# EAGLE schematic Robot Car (EAGLE 9.0.1)
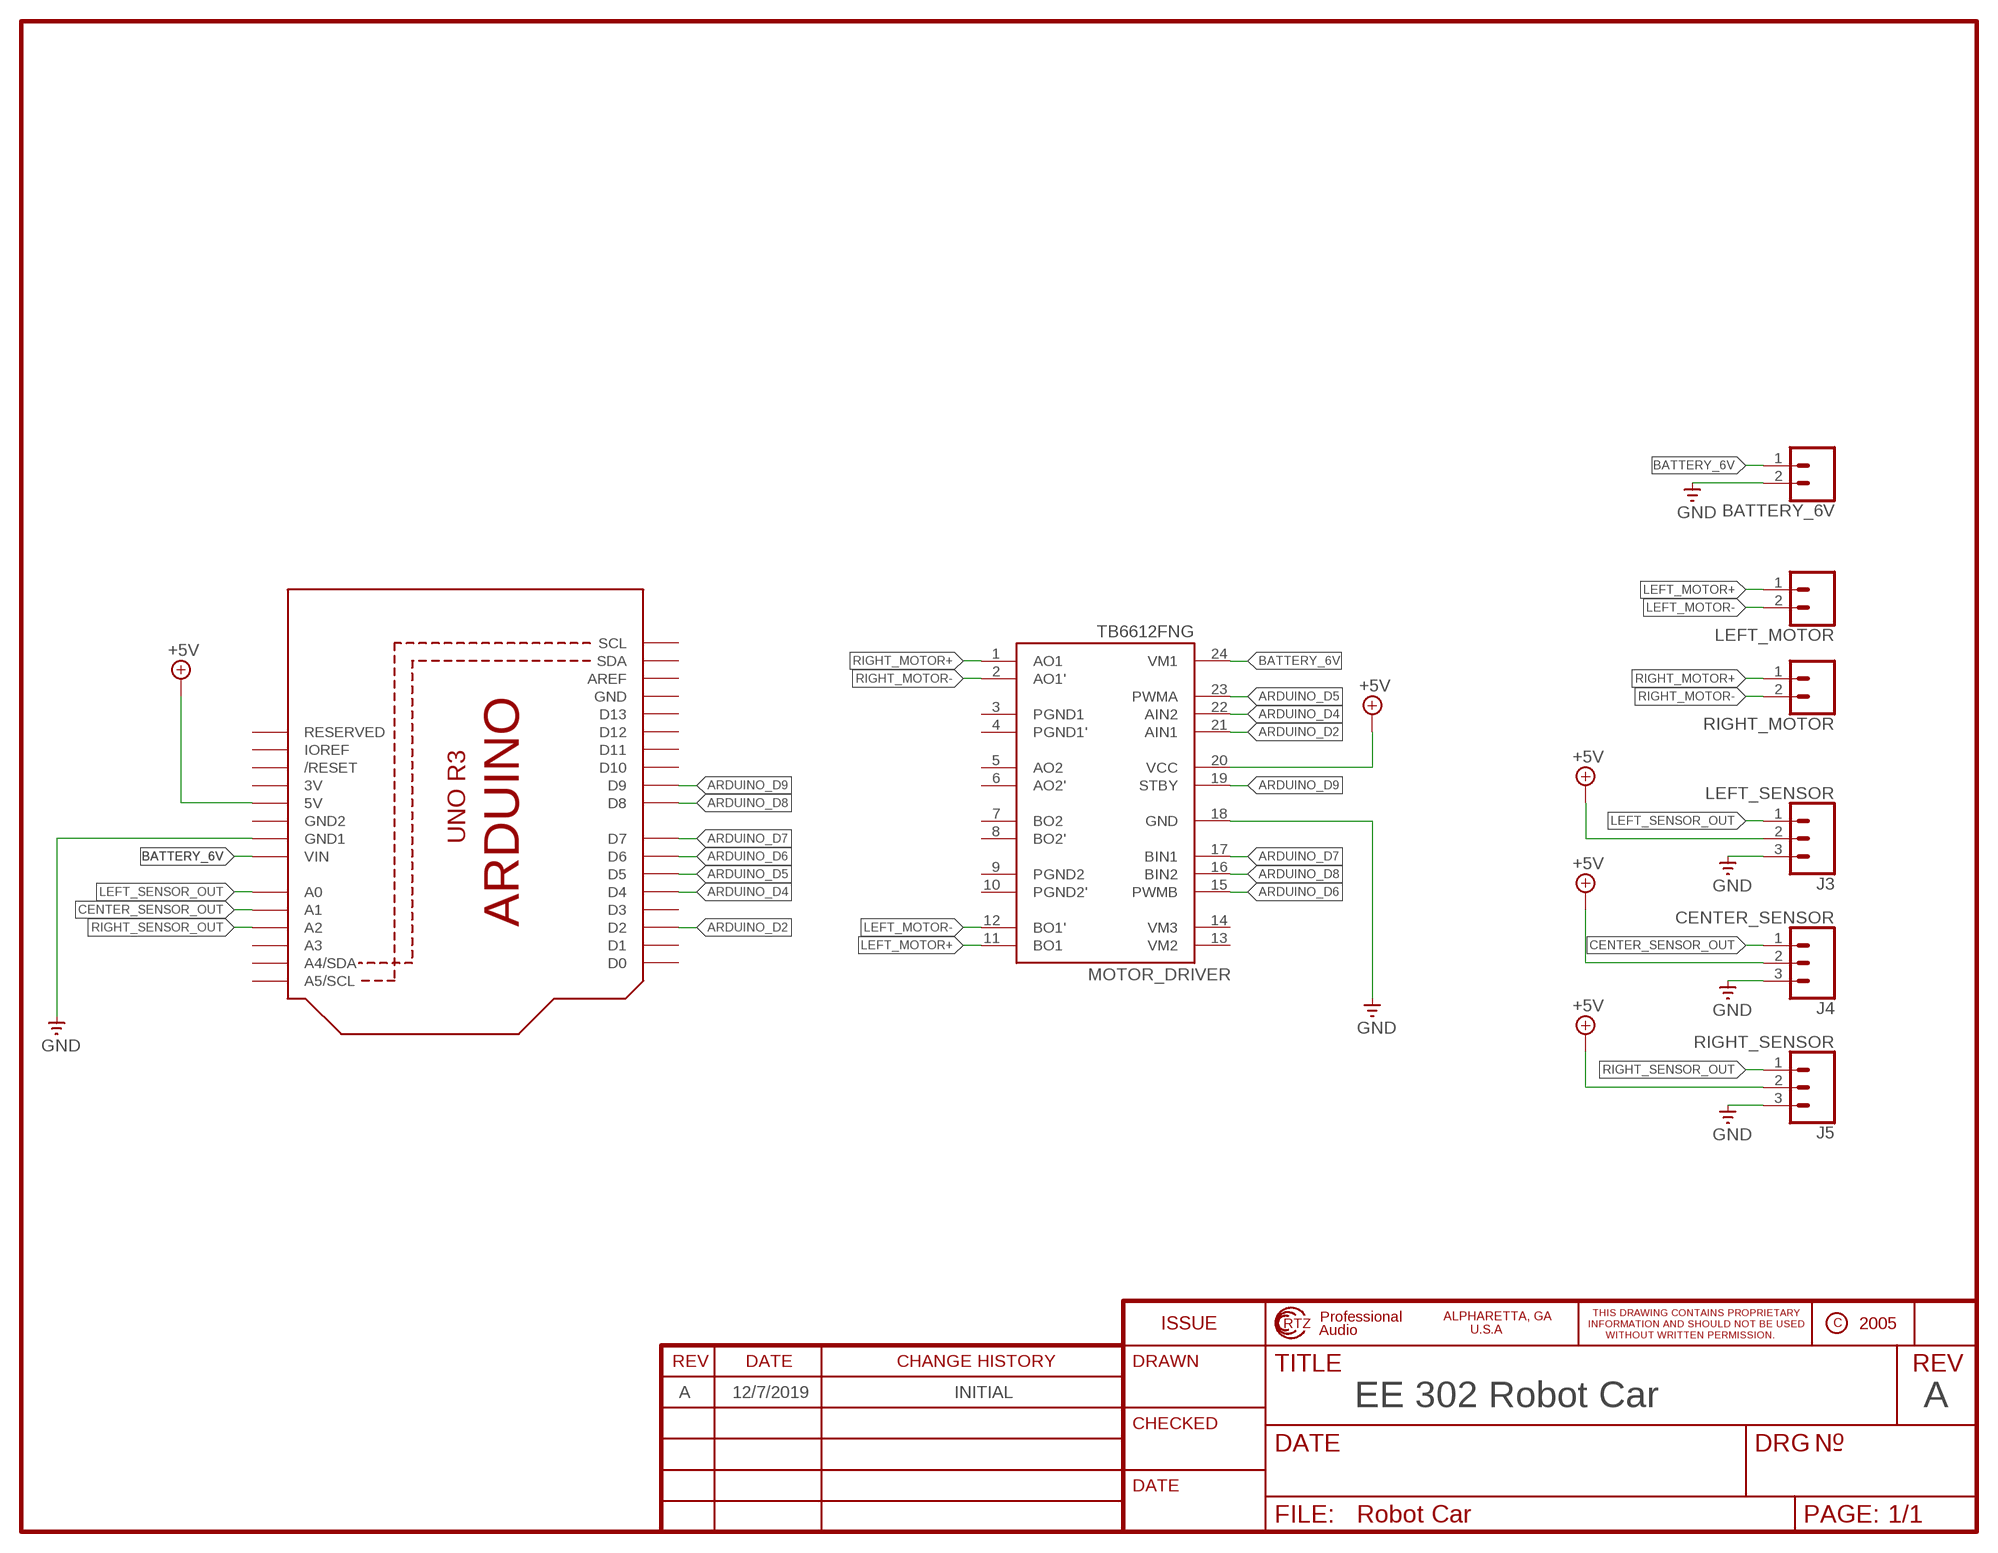
[diagram p0: schematic, sheet 1]

## Parts
BATTERY_6V  CONN_02  [1X02]
J3  LEFT_SENSOR  CONN_03  [1X03]
J4  CENTER_SENSOR  CONN_03  [1X03]
J5  RIGHT_SENSOR  CONN_03  [1X03]
LEFT_MOTOR  CONN_02  [1X02]
MOTOR_DRIVER  TB6612FNG  [SSOP24]
RIGHT_MOTOR  CONN_02  [1X02]
U1  ARDUINOR3-DIMENSION  [ARDUINOR3]

## Nets
+5V: J3.2 J4.2 J5.2 MOTOR_DRIVER.20(VCC) U1.5V
ARDUINO_D2: MOTOR_DRIVER.21(AIN1) U1.D2
ARDUINO_D4: MOTOR_DRIVER.22(AIN2) U1.D4
ARDUINO_D5: MOTOR_DRIVER.23(PWMA) U1.D5
ARDUINO_D6: MOTOR_DRIVER.15(PWMB) U1.D6
ARDUINO_D7: MOTOR_DRIVER.17(BIN1) U1.D7
ARDUINO_D8: MOTOR_DRIVER.16(BIN2) U1.D8
ARDUINO_D9: MOTOR_DRIVER.19(STBY) U1.D9
BATTERY_6V: BATTERY_6V.1 MOTOR_DRIVER.24(VM1) U1.VIN
CENTER_SENSOR_OUT: J4.1 U1.A1
GND: BATTERY_6V.2 J3.3 J4.3 J5.3 MOTOR_DRIVER.18(GND) U1.GND1
LEFT_MOTOR+: LEFT_MOTOR.1 MOTOR_DRIVER.11(BO1)
LEFT_MOTOR-: LEFT_MOTOR.2 MOTOR_DRIVER.12(BO1')
LEFT_SENSOR_OUT: J3.1 U1.A0
RIGHT_MOTOR+: MOTOR_DRIVER.1(AO1) RIGHT_MOTOR.1
RIGHT_MOTOR-: MOTOR_DRIVER.2(AO1') RIGHT_MOTOR.2
RIGHT_SENSOR_OUT: J5.1 U1.A2
Unconnected: MOTOR_DRIVER.5(AO2) MOTOR_DRIVER.6(AO2') MOTOR_DRIVER.7(BO2) MOTOR_DRIVER.8(BO2') U1.A3 U1.A4(A4/SDA) U1.A5(A5/SCL) U1.AREF U1.D0 U1.D1 U1.D3 U1.D10 U1.D11 U1.D12 U1.D13 U1.IOREF U1.RESERVED U1.RESET(/RESET) U1.SCL U1.SDA

## Notes on the sheet
- A | 12/7/2019 | INITIAL
- EE 302 Robot Car | A

## Power pins joined to a net without a drawn wire
3V: U1.3V
GND: U1.GND
GND2: U1.GND2
PGND1: MOTOR_DRIVER.3(PGND1)
PGND1': MOTOR_DRIVER.4(PGND1')
PGND2: MOTOR_DRIVER.9(PGND2)
PGND2': MOTOR_DRIVER.10(PGND2')
VM2: MOTOR_DRIVER.13(VM2)
VM3: MOTOR_DRIVER.14(VM3)

## Library data of the parts
BATTERY_6V LEFT_MOTOR RIGHT_MOTOR = SparkFun-Connectors:CONN_02: Multi connection point. Often used as Generic Header-pin footprint for 0.1 inch spaced/style header connections On any of the 0.1 inch spaced packages, you can populate with these: Break Away Headers - Straight <https://www.sparkfun.com/products/116> (PRT-00116) Break Away Male Headers - Right Angle <https://www.sparkfun.com/products/553> (PRT-00553) Female Headers <https://www.sparkfun.com/products/115> (PRT-00115) Break Away Headers - Machine Pin <https://www.sparkfun.com/products/117> (PRT-00117) Break Away Female Headers - Swiss Machine Pin <https://www.sparkfun.com/products/743> (PRT-00743) For SCREWTERMINALS and SPRING TERMINALS visit here: Screw Terimnals on SparkFun.com <https://www.sparkfun.com/search/results?term=Screw+Terminals> (5mm/3.5mm/2.54mm spacing) This device is also useful as a general connection point to wire up your design to another part of your project. Our various solder wires solder well into these plated through hole pads. Hook-Up Wire - Assortment (Stranded, 22 AWG) <https://www.sparkfun.com/products/11375> (PRT-11375) Hook-Up Wire - Assortment (Solid Core, 22 AWG) <https://www.sparkfun.com/products/11367> (PRT-11367) View the entire wire category on our website here <https://www.sparkfun.com/categories/141> Special notes: Molex polarized connector foot print use with: PRT-08233 with associated crimp pins and housings. 2.54_SCREWTERM for use with PRT-10571. 3.5mm Screw Terminal footprints for PRT-08084 5mm Screw Terminal footprints for use with PRT-08432
J3-J5 = SparkFun-Connectors:CONN_03: Multi connection point. Often used as Generic Header-pin footprint for 0.1 inch spaced/style header connections On any of the 0.1 inch spaced packages, you can populate with these: Break Away Headers - Straight <https://www.sparkfun.com/products/116> (PRT-00116) Break Away Male Headers - Right Angle <https://www.sparkfun.com/products/553> (PRT-00553) Female Headers <https://www.sparkfun.com/products/115> (PRT-00115) Break Away Headers - Machine Pin <https://www.sparkfun.com/products/117> (PRT-00117) Break Away Female Headers - Swiss Machine Pin <https://www.sparkfun.com/products/743> (PRT-00743) Stackable Header - 3 Pin (Female, 0.1") <https://www.sparkfun.com/products/13875> (PRT-13875) For SCREWTERMINALS and SPRING TERMINALS visit here: Screw Terimnals on SparkFun.com <https://www.sparkfun.com/search/results?term=Screw+Terminals> (5mm/3.5mm/2.54mm spacing) This device is also useful as a general connection point to wire up your design to another part of your project. Our various solder wires solder well into these plated through hole pads. Hook-Up Wire - Assortment (Stranded, 22 AWG) <https://www.sparkfun.com/products/11375> (PRT-11375) Hook-Up Wire - Assortment (Solid Core, 22 AWG) <https://www.sparkfun.com/products/11367> (PRT-11367) View the entire wire category on our website here <https://www.sparkfun.com/categories/141> Special notes: Molex polarized connector foot print use with SKU : PRT-08232 with associated crimp pins and housings.
MOTOR_DRIVER = adafruit:TB6612FNG: TB6612FNG MOS dual H-bridge motor driver, 1.2A current 3.2A peak 3 or 5v logic and 3-15v motor
U1 = adafruit:ARDUINOR3: This is a new object for the new Arduino R3 - with extra pins that you may want to use (such as IOref, and duplicated A4/A5